# EAGLE design d-board (EAGLE 9.6.2)
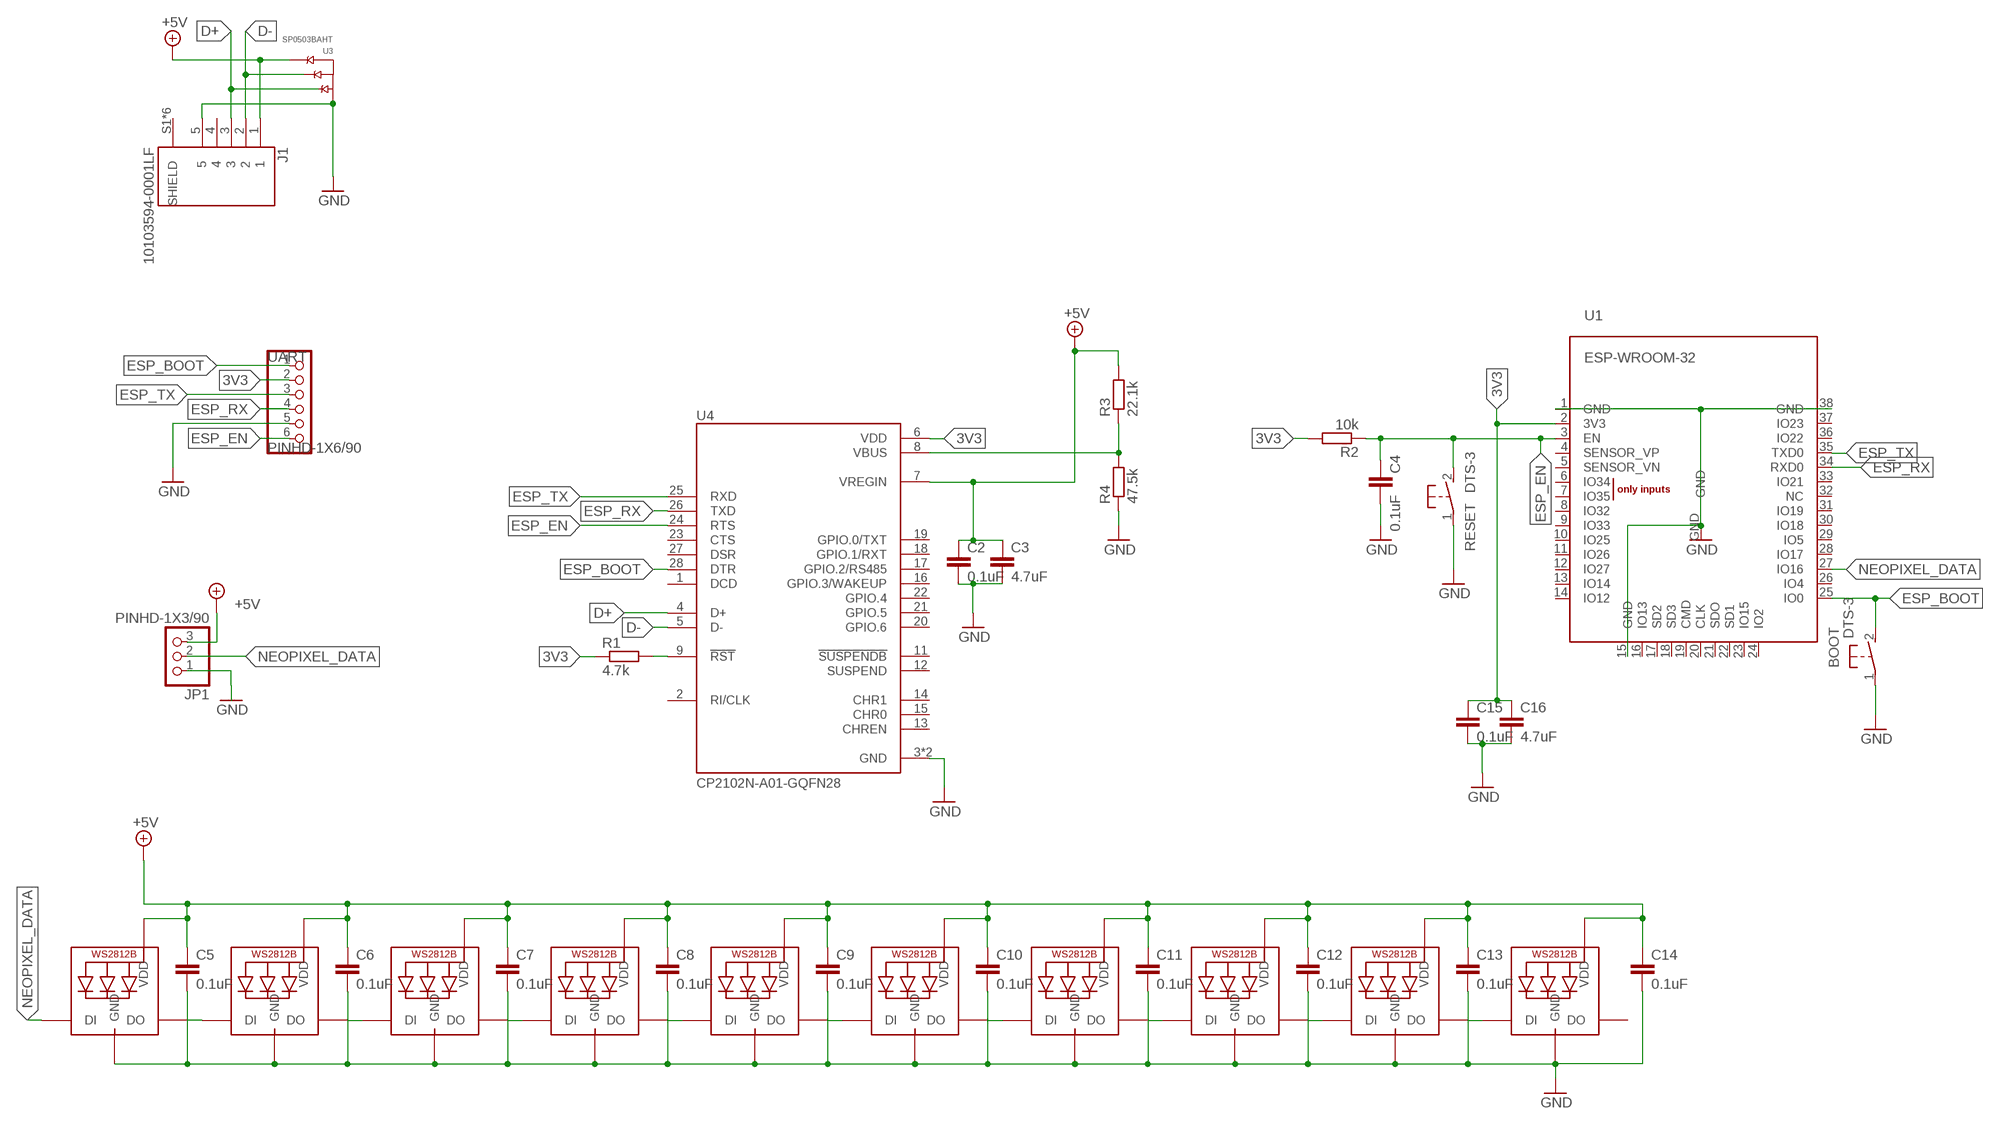
[diagram p0: schematic, sheet 1]

## Parts
BOOT  DTS-3  [DTS-3]
C2  0.1uF  C-EUC0805  [C0805]
C3  4.7uF  C-EUC0805  [C0805]
C4  0.1uF  C-EUC0805  [C0805]
C5  0.1uF  C-EUC0805  [C0805]
C6  0.1uF  C-EUC0805  [C0805]
C7  0.1uF  C-EUC0805  [C0805]
C8  0.1uF  C-EUC0805  [C0805]
C9  0.1uF  C-EUC0805  [C0805]
C10  0.1uF  C-EUC0805  [C0805]
C11  0.1uF  C-EUC0805  [C0805]
C12  0.1uF  C-EUC0805  [C0805]
C13  0.1uF  C-EUC0805  [C0805]
C14  0.1uF  C-EUC0805  [C0805]
C15  0.1uF  C-EUC0805  [C0805]
C16  4.7uF  C-EUC0805  [C0805]
J1  10103594-0001LF  [FCI_10103594-0001LF]
JP1  PINHD-1X3/90  [1X03/90]
LED1  WS2812B5050  [WS2812B]
LED2  WS2812B5050  [WS2812B]
LED3  WS2812B5050  [WS2812B]
LED4  WS2812B5050  [WS2812B]
LED5  WS2812B5050  [WS2812B]
LED6  WS2812B5050  [WS2812B]
LED7  WS2812B5050  [WS2812B]
LED8  WS2812B5050  [WS2812B]
LED9  WS2812B5050  [WS2812B]
LED10  WS2812B5050  [WS2812B]
R1  4.7k  R-EU_R0805  [R0805]
R2  10k  R-EU_R0805  [R0805]
R3  22.1k  R-EU_R0805  [R0805]
R4  47.5k  R-EU_R0805  [R0805]
RESET  DTS-3  [DTS-3]
U1  ESP-WROOM-32  [ESP-WROOM-32]
U3  SP0503BAHT  [SOT143]
U4  CP2102N-A01-GQFN28  [QFN50P500X500X80-29N]
UART  PINHD-1X6/90  [1X06/90]

## Nets
3V3: C15.1 C16.1 R1.1 R2.2 U1.2(3V3) U4.6(VDD) UART.2
+5V [power]: C2.1 C3.1 C5.1 C6.1 C7.1 C8.1 C9.1 C10.1 C11.1 C12.1 C13.1 C14.1 J1.1 JP1.3 LED1.1-VDD(VDD) LED2.1-VDD(VDD) LED3.1-VDD(VDD) LED4.1-VDD(VDD) LED5.1-VDD(VDD) LED6.1-VDD(VDD) LED7.1-VDD(VDD) LED8.1-VDD(VDD) LED9.1-VDD(VDD) LED10.1-VDD(VDD) R3.2 U3.4(C) U4.7(VREGIN)
D+: J1.3 U3.2(A) U4.4(D+)
D-: J1.2 U3.3(B) U4.5(D-)
ESP_BOOT: BOOT.2 U1.25(IO0) U4.28(DTR) UART.1
ESP_EN: C4.1 R2.1 RESET.2 U1.3(EN) U4.24(RTS) UART.6
ESP_RX: U1.34(RXD0) U4.26(TXD) UART.4
ESP_TX: U1.35(TXD0) U4.25(RXD) UART.3
GND [power]: BOOT.1 C2.2 C3.2 C4.2 C5.2 C6.2 C7.2 C8.2 C9.2 C10.2 C11.2 C12.2 C13.2 C14.2 C15.2 C16.2 J1.5 JP1.1 LED1.3-GND(GND) LED2.3-GND(GND) LED3.3-GND(GND) LED4.3-GND(GND) LED5.3-GND(GND) LED6.3-GND(GND) LED7.3-GND(GND) LED8.3-GND(GND) LED9.3-GND(GND) LED10.3-GND(GND) R4.1 RESET.1 U1.1(GND) U1.15(GND) U1.38(GND) U1.GND U3.1(GND) U4.3(GND) U4.29(GND) UART.5
N$3: R3.1 R4.2 U4.8(VBUS)
N$4: LED2.2-DOUT(DO) LED3.4-DIN(DI)
N$5: R1.2 U4.9(!RST)
N$8: LED3.2-DOUT(DO) LED4.4-DIN(DI)
N$12: LED4.2-DOUT(DO) LED5.4-DIN(DI)
N$16: LED5.2-DOUT(DO) LED6.4-DIN(DI)
N$17: LED6.2-DOUT(DO) LED7.4-DIN(DI)
N$18: LED7.2-DOUT(DO) LED8.4-DIN(DI)
N$19: LED8.2-DOUT(DO) LED9.4-DIN(DI)
N$20: LED9.2-DOUT(DO) LED10.4-DIN(DI)
N$21: LED1.2-DOUT(DO) LED2.4-DIN(DI)
NEOPIXEL_DATA: JP1.2 LED1.4-DIN(DI) U1.27(IO16)
Unconnected: J1.4 J1.S1(SHIELD) J1.S2(SHIELD) J1.S3(SHIELD) J1.S4(SHIELD) J1.S5(SHIELD) J1.S6(SHIELD) LED10.2-DOUT(DO) U1.4(SENSOR_VP) U1.5(SENSOR_VN) U1.6(IO34) U1.7(IO35) U1.8(IO32) U1.9(IO33) U1.10(IO25) U1.11(IO26) U1.12(IO27) U1.13(IO14) U1.14(IO12) U1.16(IO13) U1.17(SD2) U1.18(SD3) U1.19(CMD) U1.20(CLK) U1.21(SDO) U1.22(SD1) U1.23(IO15) U1.24(IO2) U1.26(IO4) U1.28(IO17) U1.29(IO5) U1.30(IO18) U1.31(IO19) U1.32(NC) U1.33(IO21) U1.36(IO22) U1.37(IO23) U4.1(DCD) U4.2(RI/CLK) U4.11(!SUSPENDB) U4.12(SUSPEND) U4.13(CHREN) U4.14(CHR1) U4.15(CHR0) U4.16(GPIO.3/WAKEUP) U4.17(GPIO.2/RS485) U4.18(GPIO.1/RXT) U4.19(GPIO.0/TXT) U4.20(GPIO.6) U4.21(GPIO.5) U4.22(GPIO.4) U4.23(CTS) U4.27(DSR)

## Library data of the parts
BOOT RESET = switch-tact:DTS-3
C2-C16 = rcl:C-EU: CAPACITOR, European symbol; SPICEPREFIX: C
J1 = 10103594-0001LF:10103594-0001LF: Micro Usb, 2.0 Type b, Receptacle, Smt; ARROW_ELECTRONICS-PURCHASE-URL: https://snapeda.com/shop?store=Arrow+Electronics&id=1078241; DESCRIPTION: USB - micro B USB 2.0 Receptacle Connector 5 Position Surface Mount, Right Angle; Through Hole; DIGI-KEY_PART_NUMBER: 609-4050-1-ND; DIGIKEY-PURCHASE-URL: https://snapeda.com/shop?store=DigiKey&id=1078241; MF: Amphenol ICC; MOUSER-PURCHASE-URL: https://snapeda.com/shop?store=Mouser&id=1078241; MP: 10103594-0001LF; PACKAGE: None
JP1 = Connector:PINHD-1X3: PIN HEADER; CATEGORY: CONNECTOR; SUB-CATEGORY: PIN-HEADER
LED1-LED10 = adafruit:WS2812B
R1-R4 = rcl:R-EU_: RESISTOR, European symbol; SPICEPREFIX: R
U1 = esp32:ESP-WROOM-32
U3 = SP0503BAHT:SP0503BAHT; DESCRIPTION: 8.5V Clamp Ipp Tvs Diode Surface Mount SOT-143-4; DIGI-KEY_PART_NUMBER: F2715TR-ND; MF: Littelfuse Inc.; MP: SP0503BAHT; PACKAGE: SOT-143 Littelfuse
U4 = CP2102N-A01-GQFN28:CP2102N-A01-GQFN28: Ic Bridge Usb To Uart 28qfn Check prices <https://snapeda.com/parts/CP2102N-A01-GQFN28/Silicon%20Labs/view-part/?ref=eda>; AVAILABILITY: Bad; DESCRIPTION: USB Bridge, USB to UART USB 2.0 UART Interface 28-QFN (5x5); MF: Silicon Labs; MP: CP2102N-A01-GQFN28; PACKAGE: QFN-28 Silicon Labs; PRICE: None
UART = Connector:PINHD-1X6: PIN HEADER; CATEGORY: CONNECTOR; SUB-CATEGORY: PIN-HEADER

## Net classes
1 power: width 0.051 mm

## Board
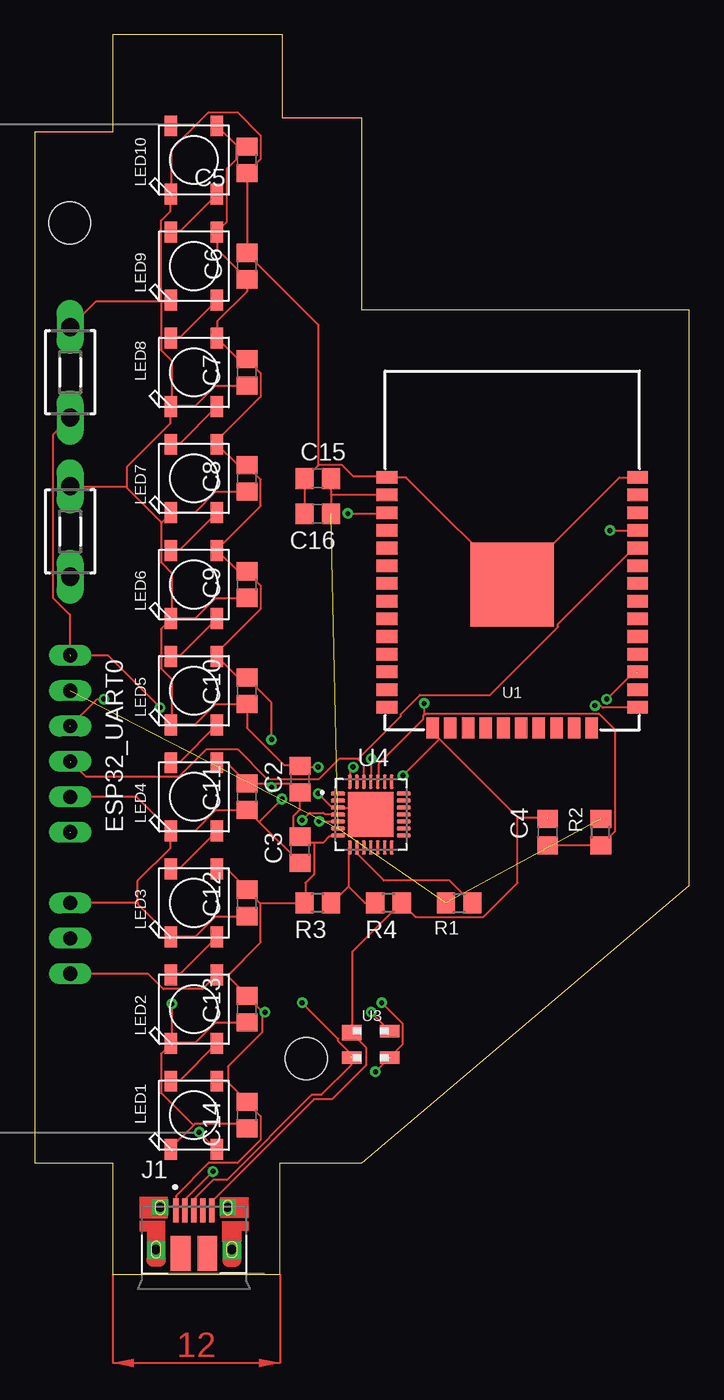
[diagram p1: board, top side]
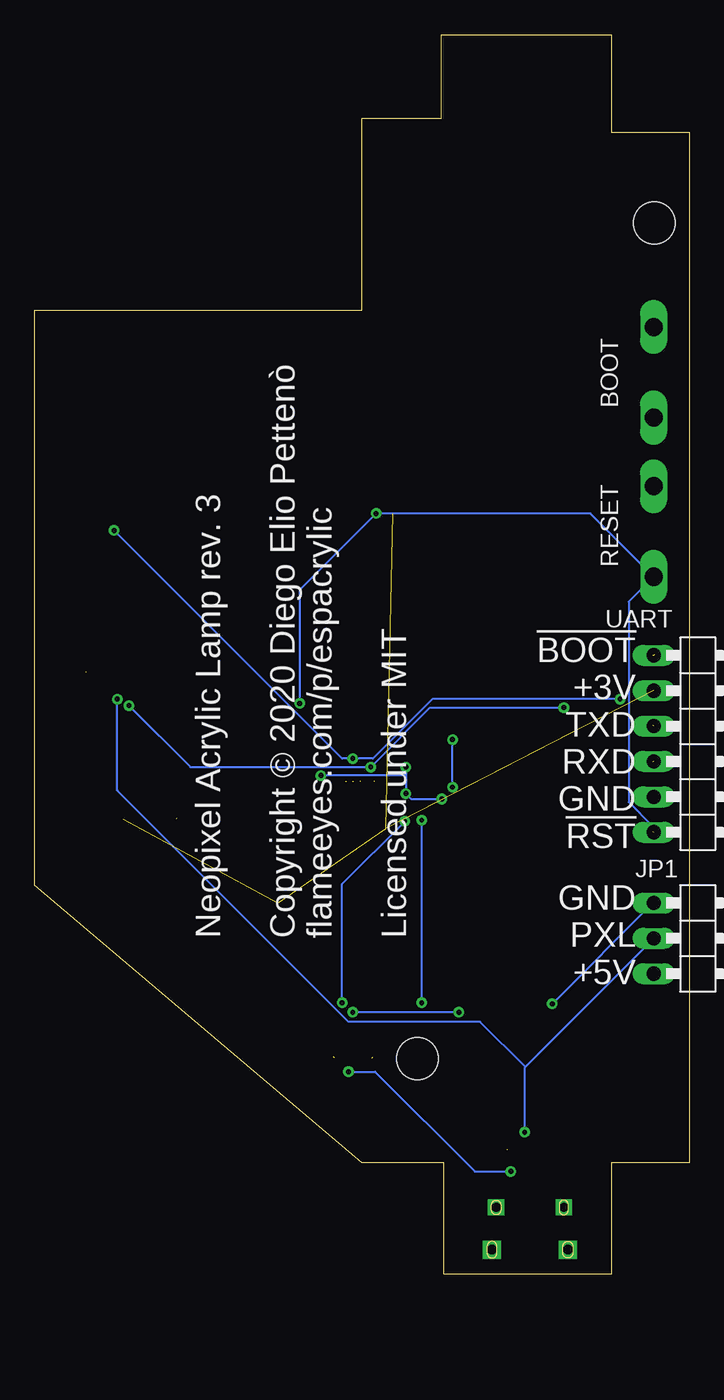
[diagram p2: board, bottom side, seen from below]

Size 46.99 x 89 mm. Coordinates in mm from the lower left corner, seen from the top.
Outline: 17.78,89 5.6,89 5.6,82 0,82 0,8 5.6,8 5.6,0 17.6,0 17.6,8 23.5,8 46.99,27.94 46.99,69.22 23.5,69.22 23.5,83 17.78,83 17.78,89
Copper layers (1*16): Top 0.035mm / dielectric 1.5mm / Bottom 0.035mm
Design rules "default": minimum track width 6mil, minimum drill 0.35mm, track to track 6mil, track to pad 6mil, pad to pad 6mil, via to via 6mil, smd to smd 6mil, copper to edge 40mil, drill to drill 6mil, minimum pad ring 10mil, minimum via ring 8mil, stop-mask expansion 4mil, vias tented up to drill 0mil, thermal gap 10mil
Holes 3 mm at 19.5,15.5 2.5,75.5

### Footprints (pad centres in the part's own frame; a part is rotated, then mirrored left to right if it is on the bottom)
DTS-3 = drill 1.3 long: 1 -3.25,0; 2 3.25,0
C0805 = smd 1.3 x 1.5: 1 -0.95,0; 2 0.95,0
FCI_10103594-0001LF = smd 0.4 x 1.75: 1 -1.3,2.825; 2 -0.65,2.825; 3 0,2.825; 4 0.65,2.825; 5 1.3,2.825 | smd 1.425 x 2.5: S1 -0.963,-0.25; S2 0.963,-0.25 | drill 0.65 pad 1.05 square: S3 -2.425,3.03; S4 2.425,3.03 | drill 0.7 pad 1.3 square: S5 -2.725,0; S6 2.725,0
1X03/90 = drill 1.016 long: 1 -2.54,-3.81; 2 0,-3.81; 3 2.54,-3.81
WS2812B = smd 1.5 x 0.9: 1-VDD 2.45,-1.65; 2-DOUT 2.45,1.65; 3-GND -2.45,1.65; 4-DIN -2.45,-1.65
R0805 = smd 1.3 x 1.5: 1 -0.95,0; 2 0.95,0
ESP-WROOM-32 = smd 0.9 x 1.5: 1 7.7,9; 2 6.43,9; 3 5.16,9; 4 3.89,9; 5 2.62,9; 6 1.35,9; 7 0.08,9; 8 -1.19,9; 9 -2.46,9; 10 -3.73,9; 11 -5,9; 12 -6.27,9; 13 -7.54,9; 14 -8.81,9; 25 -8.81,-9; 26 -7.54,-9; 27 -6.27,-9; 28 -5,-9; 29 -3.73,-9; 30 -2.46,-9; 31 -1.19,-9; 32 0.08,-9; 33 1.35,-9; 34 2.62,-9; 35 3.89,-9; 36 5.16,-9; 37 6.43,-9; 38 7.7,-9 | smd 1.5 x 0.9: 15 -10.3,5.715; 16 -10.3,4.445; 17 -10.3,3.175; 18 -10.3,1.905; 19 -10.3,0.635; 20 -10.3,-0.635; 21 -10.3,-1.905; 22 -10.3,-3.175; 23 -10.3,-4.445; 24 -10.3,-5.715 | smd 6 x 6: GND 0,0
SOT143 = smd 1.4 x 1.1: 1 -1.35,0.86 | smd 1.4 x 0.9: 2 -1.35,-0.96; 3 1.35,-0.96; 4 1.35,0.96
QFN50P500X500X80-29N = smd 1.01 x 0.27: 1 -2.36,1.5; 2 -2.36,1; 3 -2.36,0.5; 4 -2.36,0; 5 -2.36,-0.5; 6 -2.36,-1; 7 -2.36,-1.5; 15 2.36,-1.5; 16 2.36,-1; 17 2.36,-0.5; 18 2.36,0; 19 2.36,0.5; 20 2.36,1; 21 2.36,1.5 | smd 0.27 x 1.01: 8 -1.5,-2.36; 9 -1,-2.36; 10 -0.5,-2.36; 11 0,-2.36; 12 0.5,-2.36; 13 1,-2.36; 14 1.5,-2.36; 22 1.5,2.36; 23 1,2.36; 24 0.5,2.36; 25 0,2.36; 26 -0.5,2.36; 27 -1,2.36; 28 -1.5,2.36 | smd 3.25 x 3.25: 29 0,0
1X06/90 = drill 1.016 long: 1 -6.35,-3.81; 2 -3.81,-3.81; 3 -1.27,-3.81; 4 1.27,-3.81; 5 3.81,-3.81; 6 6.35,-3.81

### Placement (x,y rotation side)
BOOT  2.54,64.77 270 top
C2  19.05,35.56 90 top
C3  19.05,30.48 270 top
C4  36.83,31.75 90 top
C5  15.24,80.01 270 top
C6  15.24,72.39 90 top
C7  15.24,64.77 270 top
C8  15.24,57.15 270 top
C9  15.24,49.53 270 top
C10  15.24,41.91 270 top
C11  15.24,34.29 270 top
C12  15.24,26.67 270 top
C13  15.24,19.05 270 top
C14  15.24,11.43 270 top
C15  20.32,57.15 180 top
C16  20.32,54.61 180 top
J1  11.43,1.78 0 top
JP1  -1.27,24.13 270 bottom
LED1  11.43,11.43 90 top
LED2  11.43,19.05 90 top
LED3  11.43,26.67 90 top
LED4  11.43,34.29 90 top
LED5  11.43,41.91 90 top
LED6  11.43,49.53 90 top
LED7  11.43,57.15 90 top
LED8  11.43,64.77 90 top
LED9  11.43,72.39 90 top
LED10  11.43,80.01 90 top
R1  30.48,26.67 0 top
R2  40.64,31.75 90 top
R3  20.32,26.67 180 top
R4  25.4,26.67 180 top
RESET  2.54,53.34 270 top
U1  34.29,49.53 90 top
U3  24.13,16.51 0 top
U4  24.13,33.02 0 top
UART  -1.27,38.1 270 bottom

### Tracks (layer width: path | path; a pad name or v marks a point on that pad's centre or on a via)
3V3  (4 unrouted)
  Top 0.152: 21.26,56.01 C15.1 | 21.26,56.01 21.26,54.63 C16.1 | 21.26,56.01 25.22,56.01 U1.2
+5V  (via drill 0.35)
  Top 0.152: 14.52,81.04 13.11,82.45 LED10.1-VDD | 14.52,81.04 14.55,81 15.24,81 C5.1 | 14.52,81.04 14.48,81 14.48,80.09 13.79,79.4 13.79,75.59 13.11,74.91 LED9.1-VDD 13.11,74.83 13.11,73.61 15.24,71.48 C6.1 15.24,70.56 13.11,68.43 13.11,67.28 LED8.1-VDD 13.11,67.21 14.55,65.76 15.24,65.76 C7.1 15.24,65.68 16.23,64.69 16.23,63.02 13.11,59.89 13.11,59.66 LED7.1-VDD 13.11,59.59 14.55,58.14 15.24,58.14 C8.1 15.24,58.06 16.23,57.07 16.23,55.17 13.11,52.05 LED6.1-VDD 13.11,51.97 14.55,50.52 15.24,50.52 C9.1 15.24,50.44 16.23,49.45 16.23,47.78 13.11,44.65 13.11,44.42 LED5.1-VDD 13.11,44.35 14.55,42.9 15.24,42.9 C10.1 15.24,42.82 16.99,41.07 v16.99,38.41 | LED3.1-VDD 13.11,29.11 13.79,29.11 15.24,27.66 C12.1 15.24,27.58 16.15,26.67 16.23,26.67 | 16.23,26.67 R3.2 19.43,26.67 19.43,28.12 20.04,28.73 20.04,31.01 | LED4.1-VDD 13.11,36.73 13.79,36.73 15.24,35.28 C11.1 15.24,35.2 16.99,35.2 | 20.04,31.01 19.43,31.01 19.05,31.39 C3.1 19.05,31.47 18.59,31.93 18.59,32.92 19.05,33.38 C2.1 19.05,34.67 18.52,35.2 16.99,35.2 | 20.04,31.01 20.73,31.01 21.18,31.47 21.72,31.47 U4.7 | 13.83,13.83 15.24,12.42 C14.1 15.24,12.34 16.23,11.35 16.23,9.68 14.55,8 12.5,8 10.13,5.64 10.13,4.65 J1.1 | 13.83,13.83 13.79,13.87 13.11,13.87 LED1.1-VDD | v24.16,18.82 25.45,17.53 U3.4 | 13.83,21.45 15.24,20.04 C13.1 15.24,19.96 16.38,18.82 v16.54,18.82 16.31,18.82 16.31,17.37 13.87,14.94 13.87,13.87 13.83,13.83 | 13.83,21.45 13.79,21.49 13.11,21.49 LED2.1-VDD 13.03,21.49 12.04,20.5 9.22,20.5 8.15,21.57 2.59,21.57 JP1.3 | 16.23,26.67 16.23,23.85 13.83,21.45 | 16.99,35.2 v16.99,34.98
  Bottom 0.152: v16.54,18.82 v24.16,18.82 | v16.99,34.98 v16.99,38.41
D+  (via drill 0.35)  (1 unrouted)
  Top 0.152: v19.2,32.61 19.74,33.15 20.73,33.15 20.8,33.07 21.72,33.07 U4.4 | v19.2,19.51 21.79,16.92 21.79,16.76 22.71,15.85 22.71,15.62 | J1.3 11.43,5.41 12.8,6.78 13.79,6.78 19.89,12.88 20.57,12.88 22.71,15.01 22.71,15.54 U3.2
  Bottom 0.152: v19.2,19.51 v19.2,32.61
D-  (via drill 0.35)  (1 unrouted)
  Top 0.152: v20.42,32.54 21.72,32.54 U4.5 | v24.92,19.51 26.44,17.98 26.44,16.54 25.53,15.62 | v12.8,7.39 10.82,5.41 10.82,4.65 J1.2 | v24.46,14.55 25.45,15.54 U3.3
  Bottom 0.152: v20.42,32.54 24.92,28.04 v24.92,19.51 | v12.8,7.39 15.39,7.39 22.55,14.55 v24.46,14.55
ESP_BOOT  (via drill 0.35)  (3 unrouted)
  Top 0.152: 2.52,44.5 2.52,47.4 1.29,48.62 1.29,60.27 2.52,61.49 BOOT.2 | 22.63,35.43 22.63,36.2 v22.86,36.42 | v40.23,40.84 40.62,40.84 40.77,40.69 43.28,40.69 U1.25 | 2.59,44.42 5.26,44.42 v8.99,40.69
  Bottom 0.152: v40.23,40.84 35.81,36.42 v22.86,36.42 18.59,40.69 v8.99,40.69
ESP_EN  (via drill 0.35)  (2 unrouted)
  Top 0.152: 24.69,35.43 24.69,36.65 27.89,39.85 27.89,40.08 28,40.2 | 28,40.2 28.04,40.23 40.54,40.23 41.68,39.09 41.68,31.85 40.69,30.86 R2.1 40.62,30.79 36.88,30.79 C4.1 | v22.48,54.63 25.22,54.63 U1.3 | v27.96,41 27.96,40.23 28,40.2
  Bottom 0.152: 2.59,31.77 2.59,32.16 4.34,33.91 4.34,48.31 2.59,50.06 RESET.2 2.59,50.14 7.09,54.63 v22.48,54.63 27.96,49.15 v27.96,41
ESP_RX  (2 unrouted)
  Top 0.152: 23.62,35.43 23.62,36.58 23.2,36.99 | 23.2,36.99 23.16,37.03 21.87,37.03 20.42,35.59 16.69,35.59 14.55,37.72 12.34,37.72 10.36,35.74 3.66,35.74 2.59,36.8 | 23.2,36.99 26.29,40.08 26.29,40.23 27.66,41.6 32.69,41.6 37.57,46.48 37.57,46.71 42.98,52.12 43.28,52.12 U1.34
ESP_TX  (via drill 0.35)  (2 unrouted)
  Top 0.152: v24.16,37.03 24.16,35.43 | v4.95,41.3 4.5,41.3 2.59,39.4 | v41.3,53.42 U1.35
  Bottom 0.152: v4.95,41.3 18.44,41.3 22.71,37.03 v24.16,37.03 24.92,37.03 v41.3,53.42
GND  (via drill 0.35)  (1 unrouted)
  Top 0.152: U1.15 28.57,38.94 29.07,38.44 | 34.71,32.8 34.75,32.77 36.8,32.77 | 34.71,32.8 29.07,38.44 | J1.5 12.8,4.65 12.8,5.33 20.04,12.57 21.34,12.57 23.77,15.01 23.77,16.31 22.78,17.3 U3.1 22.78,23.16 26.29,26.67 R4.1 26.36,26.67 27.36,25.68 32.23,25.68 34.67,28.12 34.67,32.77 34.71,32.8 | LED4.3-GND 9.83,31.85 11.51,31.85 12.95,33.3 15.24,33.3 C11.2 15.24,33.38 16.12,32.5 | 16.12,32.5 19.05,29.57 C3.2 | UART.5 7.32,34.29 9.75,31.85 LED4.3-GND | 11.39,10.71 11.51,10.82 14.94,10.82 15.24,10.52 C14.2 | 11.39,10.71 9.83,9.14 9.83,8.99 LED1.3-GND | LED2.3-GND 9.83,16.61 11.51,16.61 12.95,18.06 15.24,18.06 C13.2 | 11.39,10.71 9.07,13.03 9.07,15.85 9.75,16.54 LED2.3-GND | C12.2 15.24,25.68 12.95,25.68 11.51,24.23 9.83,24.23 LED3.3-GND 9.75,24.23 7.35,26.63 | JP1.1 7.32,26.67 7.35,26.63 | v9.83,19.43 9.83,16.69 LED2.3-GND | LED4.3-GND 9.75,31.77 9.75,30.63 7.39,28.27 7.39,26.67 7.35,26.63 | C16.2 19.36,54.63 19.36,57.15 C15.2 19.43,57.15 20.38,58.1 | 20.38,58.1 20.42,58.14 22.02,58.14 22.86,57.3 25.22,57.3 U1.1 26.67,57.23 34.29,49.61 U1.GND 41.99,57.23 U1.38 | LED8.3-GND 9.83,62.33 11.51,62.33 12.95,63.78 15.24,63.78 C7.2 | 9.07,69.88 4.42,69.88 2.59,68.05 BOOT.1 | 9.07,69.88 9.75,69.88 LED9.3-GND | 9.07,69.88 9.07,75.67 9.75,76.35 9.75,77.5 LED10.3-GND 9.83,77.57 9.83,80.77 12.5,83.44 14.55,83.44 16.23,81.76 16.23,80.09 15.24,79.1 C5.2 C6.2 15.24,73.3 20.34,68.2 20.34,58.14 20.38,58.1 | 9.07,69.88 9.07,66.37 9.83,65.61 9.83,62.41 LED8.3-GND | U4.29 23.7,33.45 21.79,33.45 U4.3 21.72,33.53 21.34,33.53 v20.34,34.52 | 15.24,40.92 12.95,40.92 11.51,39.47 9.83,39.47 LED5.3-GND 9.83,39.55 9.83,42.75 9.07,43.51 9.07,46.33 9.75,47.02 LED6.3-GND
  Top 0.152: 15.24,40.92 15.24,39.24 17.91,36.58 19.05,36.58 C2.2 19.13,36.42 v20.34,36.42 | 15.24,40.92 C10.2 | LED6.3-GND 9.83,47.09 11.51,47.09 12.95,48.54 15.24,48.54 C9.2 | C8.2 15.24,56.16 12.95,56.16 11.51,54.71 9.83,54.71 LED7.3-GND 9.75,54.63 9.11,53.99 | 9.11,53.99 9.07,53.95 9.07,51.13 9.83,50.37 9.83,47.17 LED6.3-GND | 9.11,53.99 6.59,56.5 | 6.59,56.5 6.55,56.54 2.59,56.54 RESET.1 | LED8.3-GND 9.75,62.26 9.75,61.11 6.63,57.99 6.63,56.54 6.59,56.5 | v17.75,34.14 16.12,32.5 | v26.44,35.81 29.07,38.44
  Bottom 0.152: v9.83,19.43 2.59,26.67 JP1.1 | v20.34,36.42 20.34,35.81 | 20.34,35.81 v20.34,34.52 19.96,34.14 v17.75,34.14 | 20.34,35.81 v26.44,35.81
N$3
  Top 0.152: 22.52,27.85 21.34,26.67 R3.1 | 22.52,27.85 22.55,27.89 22.55,30.63 U4.8 | R4.2 23.7,26.67 22.52,27.85
N$4
  Top 0.152: LED2.2-DOUT 9.83,21.57 10.44,21.57 13.03,24.16 LED3.4-DIN
N$5
  Top 0.152: U4.9 23.16,30.63 23.16,30.18 25.07,28.27 29.79,28.27 31.39,26.67 R1.2
N$8
  Top 0.152: LED3.2-DOUT 9.83,29.18 10.44,29.18 13.03,31.77 LED4.4-DIN
N$12
  Top 0.152: LED4.2-DOUT 9.83,36.8 10.44,36.8 13.03,39.4 LED5.4-DIN
N$16
  Top 0.152: LED5.2-DOUT 9.83,44.42 10.44,44.42 13.03,47.02 LED6.4-DIN
N$17
  Top 0.152: LED6.2-DOUT 9.83,52.05 10.44,52.05 13.03,54.63 LED7.4-DIN
N$18
  Top 0.152: LED7.2-DOUT 9.83,59.66 10.44,59.66 13.03,62.26 LED8.4-DIN
N$19
  Top 0.152: LED8.2-DOUT 9.83,67.28 10.44,67.28 13.03,69.88 LED9.4-DIN
N$20
  Top 0.152: LED9.2-DOUT 9.83,74.91 10.44,74.91 13.03,77.5 LED10.4-DIN
N$21
  Top 0.152: LED1.2-DOUT 9.83,13.95 10.44,13.95 13.03,16.54 LED2.4-DIN
NEOPIXEL_DATA  (via drill 0.35)  (2 unrouted)
  Top 0.152: v11.81,10.21 13.03,8.99 | 43.28,43.2 42.98,43.2 v41.07,41.3
  Bottom 0.152: v11.81,10.21 11.81,14.86 11.77,14.9 | JP1.2 11.77,14.9 | v41.07,41.3 41.07,34.75 24.46,18.14 15.01,18.14 11.77,14.9
(copper drawn outside any net)
  shapes: Top area x1

### Text on the board
tPlace: ESP32_UART0
bPlace: !BOOT / +3V / TXD / RXD / GND / !RST | GND / PXL / +5V | Neopixel Acrylic Lamp rev. 3 / / Copyright © 2020 Diego Elio Pettenò / flameeyes.com/p/espacrylic / / Licensed under MIT